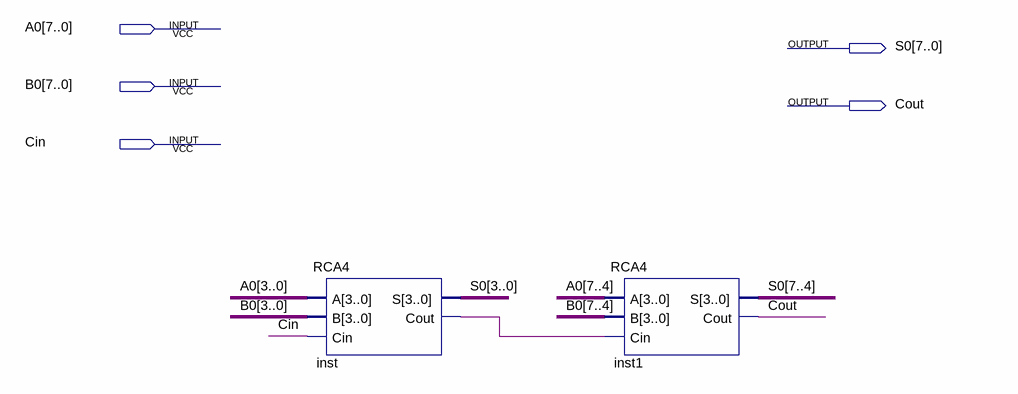
[diagram p0: schematic sheet]
// Quartus schematic RCA8.bdf as structural Verilog: 2 symbols, 5 pins
module RCA8 (
  input  [7:0] A0,
  input  [7:0] B0,
  input  Cin,
  output [7:0] S0,
  output Cout
);

  wire inst_cout;

  RCA4 inst (.A(A0[3:0]), .B(B0[3:0]), .Cin(Cin), .S(S0[3:0]), .Cout(inst_cout));
  RCA4 inst1 (.A(A0[7:4]), .B(B0[7:4]), .Cin(inst_cout), .S(S0[7:4]), .Cout(Cout));
endmodule
